# EAGLE design board (EAGLE 9.5.2)
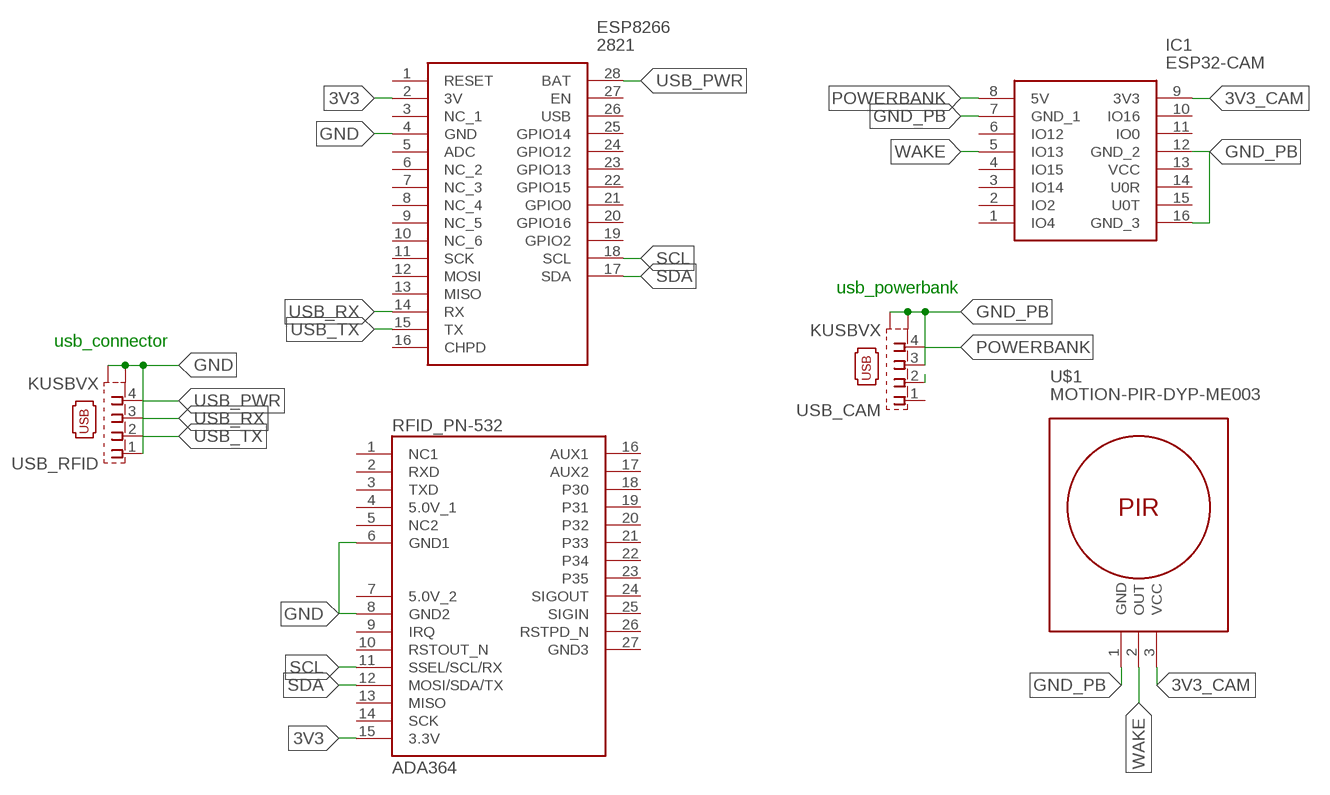
[diagram p0: schematic, sheet 1]

## Parts
ESP8266  2821  [2821]
IC1  ESP32-CAM  [ESP32CAM]
RFID_PN-532  ADA364  [ADAFRUIT_ADA364]
U$1  MOTION-PIR-DYP-ME003  [MOTION-PIR-DYP-ME003]
USB_CAM  KUSBVX  [KUSBVX]
USB_RFID  KUSBVX  [KUSBVX]

## Nets
3V3: ESP8266.2(3V) RFID_PN-532.15(3.3V)
3V3_CAM: IC1.9(3V3) U$1.3(VCC)
GND: ESP8266.4(GND) RFID_PN-532.6(GND1) RFID_PN-532.8(GND2) USB_RFID.1 USB_RFID.M1(S1) USB_RFID.M2(S2)
GND_PB: IC1.7(GND_1) IC1.12(GND_2) IC1.16(GND_3) U$1.1(GND) USB_CAM.3 USB_CAM.M1(S1) USB_CAM.M2(S2)
N$1: USB_CAM.1 USB_CAM.2
POWERBANK: IC1.8(5V) USB_CAM.4
SCL: ESP8266.18(SCL) RFID_PN-532.11(SSEL/SCL/RX)
SDA: ESP8266.17(SDA) RFID_PN-532.12(MOSI/SDA/TX)
USB_PWR: ESP8266.28(BAT) USB_RFID.4
USB_RX: ESP8266.14(RX) USB_RFID.3
USB_TX: ESP8266.15(TX) USB_RFID.2
WAKE: IC1.5(IO13) U$1.2(OUT)
Unconnected: ESP8266.1(RESET) ESP8266.3(NC_1) ESP8266.5(ADC) ESP8266.6(NC_2) ESP8266.7(NC_3) ESP8266.8(NC_4) ESP8266.9(NC_5) ESP8266.10(NC_6) ESP8266.11(SCK) ESP8266.12(MOSI) ESP8266.13(MISO) ESP8266.16(CHPD) ESP8266.19(GPIO2) ESP8266.20(GPIO16) ESP8266.21(GPIO0) ESP8266.22(GPIO15) ESP8266.23(GPIO13) ESP8266.24(GPIO12) ESP8266.25(GPIO14) ESP8266.26(USB) ESP8266.27(EN) IC1.1(IO4) IC1.2(IO2) IC1.3(IO14) IC1.4(IO15) IC1.6(IO12) IC1.10(IO16) IC1.11(IO0) IC1.13(VCC) IC1.14(U0R) IC1.15(U0T) RFID_PN-532.1(NC1) RFID_PN-532.2(RXD) RFID_PN-532.3(TXD) RFID_PN-532.4(5.0V_1) RFID_PN-532.5(NC2) RFID_PN-532.7(5.0V_2) RFID_PN-532.9(IRQ) RFID_PN-532.10(RSTOUT_N) RFID_PN-532.13(MISO) RFID_PN-532.14(SCK) RFID_PN-532.16(AUX1) RFID_PN-532.17(AUX2) RFID_PN-532.18(P30) RFID_PN-532.19(P31) RFID_PN-532.20(P32) RFID_PN-532.21(P33) RFID_PN-532.22(P34) RFID_PN-532.23(P35) RFID_PN-532.24(SIGOUT) RFID_PN-532.25(SIGIN) RFID_PN-532.26(RSTPD_N) RFID_PN-532.27(GND3)

## Notes on the sheet
- usb_powerbank
- usb_connector

## Library data of the parts
ESP8266 = 2821:2821: ADAFRUIT - 2821 - Adafruit Feather HUZZAH ESP8266 Source: Datasheet <https://cdn-learn.adafruit.com/downloads/pdf/adafruit-feather-huzzah-esp8266.pdf>; ALLIED_NUMBER: 70929322; ALLIED_PRICE-STOCK: https://www.alliedelec.com/adafruit-industries-2821/70929322/; DESCRIPTION: ADAFRUIT - 2821 - Adafruit Feather HUZZAH ESP8266; HEIGHT: 4mm; MANUFACTURER_NAME: Adafruit; MANUFACTURER_PART_NUMBER: 2821; MOUSER_PART_NUMBER: 485-2821; MOUSER_PRICE-STOCK: https://www.mouser.com/Search/Refine.aspx?Keyword=485-2821; RS_PART_NUMBER: 1245505; RS_PRICE-STOCK: http://uk.rs-online.com/web/p/products/1245505
IC1 = ESP32-CAM:ESP32-CAM: Modules PCBA Module RoHS Source: Datasheet <https://datasheet.lcsc.com/szlcsc/Ai-Thinker-ESP32-CAM_C277946.pdf>; DESCRIPTION: Modules PCBA Module RoHS; HEIGHT: 5mm; MANUFACTURER_NAME: Ai-Thinker; MANUFACTURER_PART_NUMBER: ESP32-CAM
RFID_PN-532 = ADA364:ADA364: PN532 NFC/RFID controller breakout board; AVAILABILITY: Unavailable; DESCRIPTION: PN532 NFC/RFID controller breakout board; MF: Adafruit Industries; MP: ADA364; PACKAGE: None; PRICE: None
U$1 = diy-modules:MOTION-PIR-DYP-ME003: PIR Motion Sensor Module DYP-ME003 based on BISS0001 pyroelectic detector Click here to find device on ebay.com <http://www.ebay.com/sch/dyp+me003>
USB_CAM USB_RFID = con-kycon:KUSBVX: Vertical,Top Entry Universal Serial Bus Connector KUSBVX Series Source: KYCON Sibalco USB vertical socket KUSBV.pdf

## Board
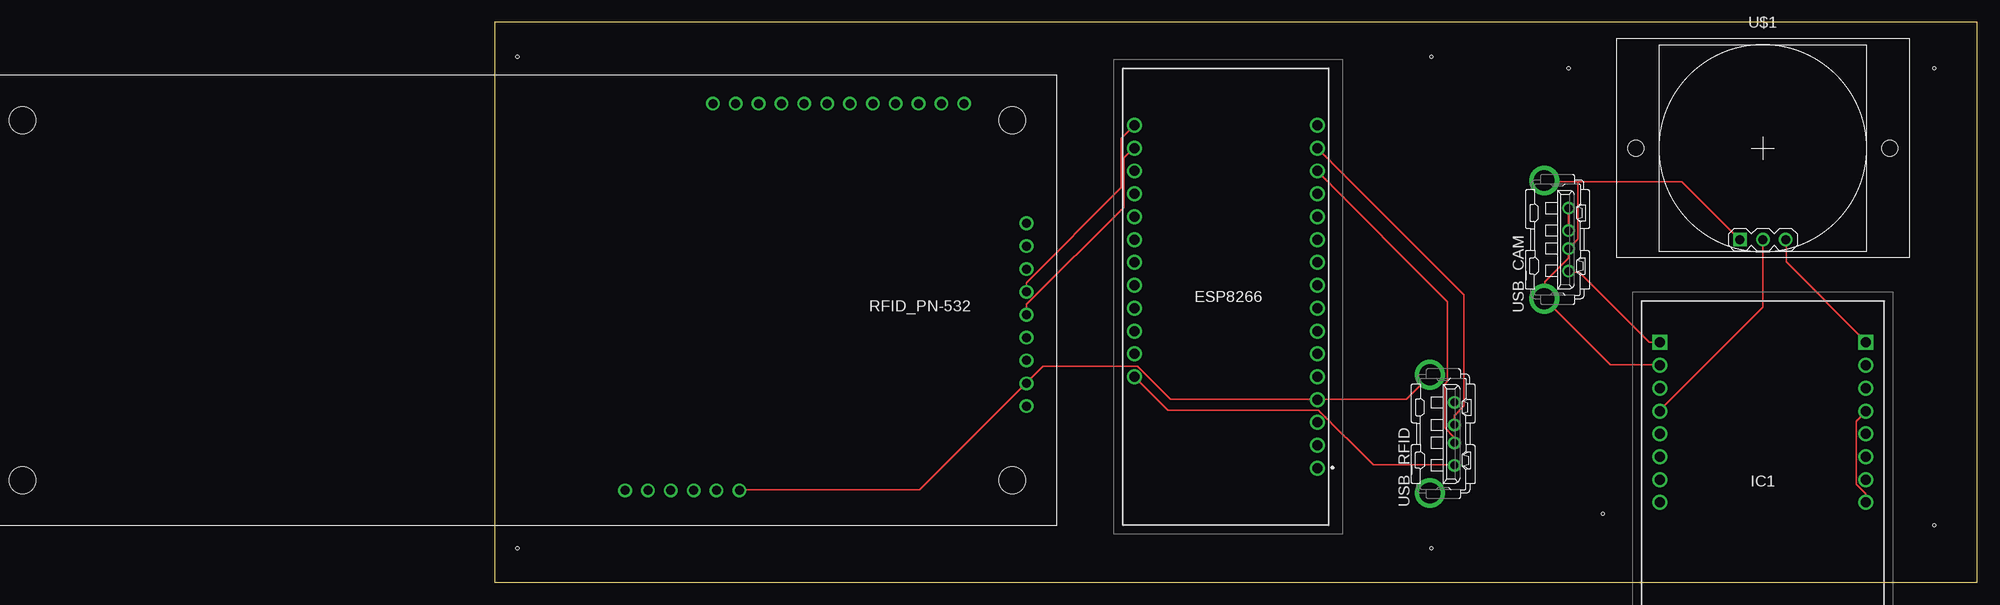
[diagram p1: board, top side]
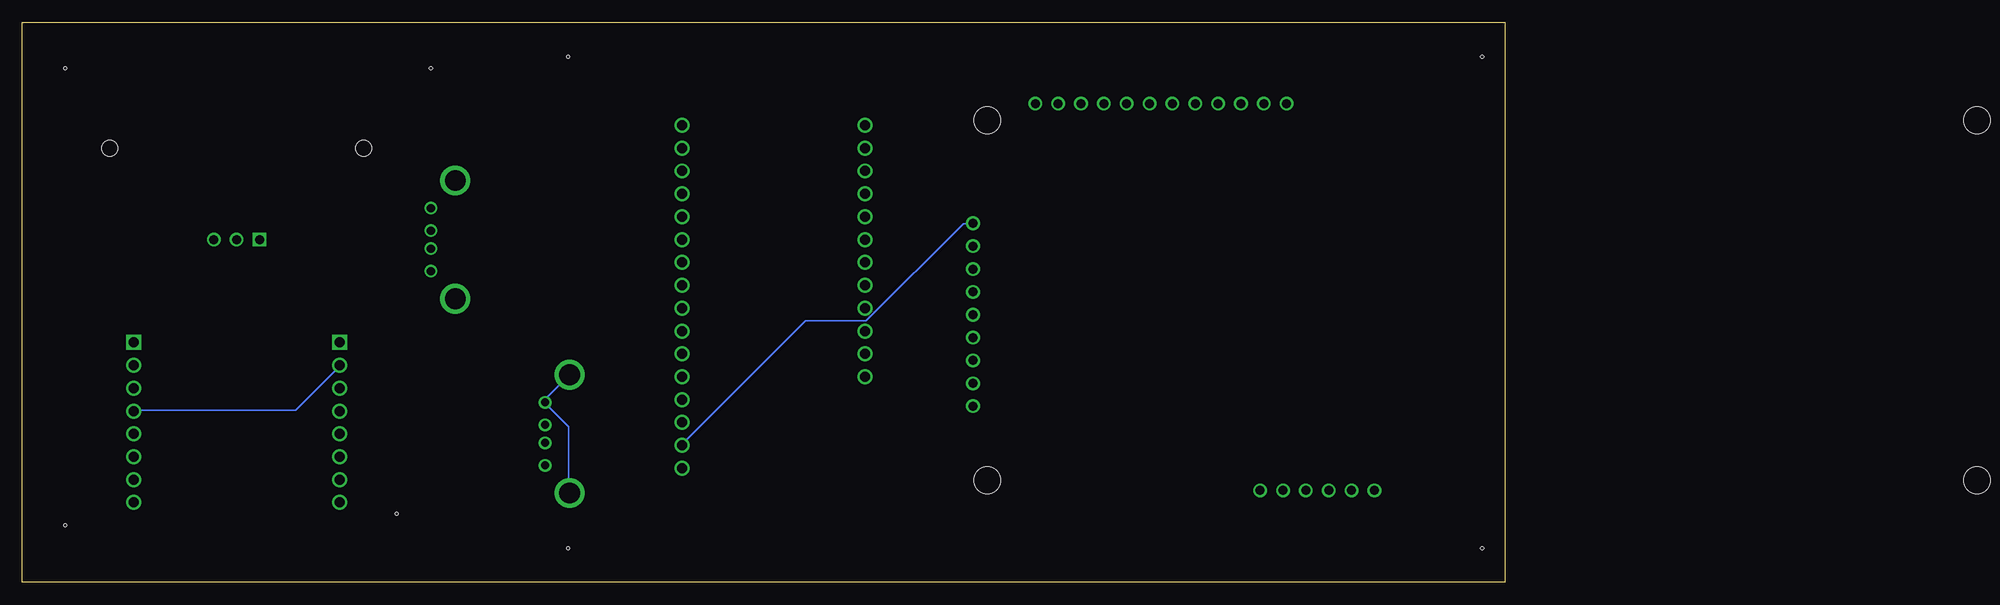
[diagram p2: board, bottom side, seen from below]

Size 164.77 x 62.22 mm. Coordinates in mm from the lower left corner, seen from the top.
Outline: 0,0 164.77,0 164.77,62.22 0,62.22 0,0
Copper layers (1*16): Top 0.035mm / dielectric 1.5mm / Bottom 0.035mm
Design rules "default": minimum track width 6mil, minimum drill 0.35mm, track to track 6mil, track to pad 6mil, pad to pad 6mil, via to via 6mil, smd to smd 6mil, copper to edge 40mil, drill to drill 6mil, minimum pad ring 10mil, minimum via ring 8mil, stop-mask expansion 4mil, vias tented up to drill 0mil, thermal gap 10mil
Holes 0.35 mm at 2.54,58.42 2.54,3.81 104.14,3.81 104.14,58.42 119.38,57.15 123.19,7.62 160.02,57.15 160.02,6.35

### Footprints (pad centres in the part's own frame; a part is rotated, then mirrored left to right if it is on the bottom)
2821 = drill 1.11 pad 1.665: 1 -35.56,0; 2 -33.02,0; 3 -30.48,0; 4 -27.94,0; 5 -25.4,0; 6 -22.86,0; 7 -20.32,0; 8 -17.78,0; 9 -15.24,0; 10 -12.7,0; 11 -10.16,0; 12 -7.62,0; 13 -5.08,0; 14 -2.54,0; 15 0,0; 16 2.54,0; 17 2.54,20.32; 18 0,20.32; 19 -2.54,20.32; 20 -5.08,20.32; 21 -7.62,20.32; 22 -10.16,20.32; 23 -12.7,20.32; 24 -15.24,20.32; 25 -17.78,20.32; 26 -20.32,20.32; 27 -22.86,20.32; 28 -25.4,20.32
ESP32CAM = drill 1.11 pad 1.665: 1 0,0; 2 0,2.54; 3 0,5.08; 4 0,7.62; 5 0,10.16; 6 0,12.7; 7 0,15.24; 10 22.86,15.24; 11 22.86,12.7; 12 22.86,10.16; 13 22.86,7.62; 14 22.86,5.08; 15 22.86,2.54; 16 22.86,0 | drill 1.11 pad 1.665 square: 8 0,17.78; 9 22.86,17.78
ADAFRUIT_ADA364 = drill 1: 1 11.976,3.874; 2 14.516,3.874; 3 17.056,3.874; 4 19.596,3.874; 5 22.136,3.874; 6 24.676,3.874; 7 56.59,13.24; 8 56.59,15.78; 9 56.59,18.32; 10 56.59,20.86; 11 56.59,23.4; 12 56.59,25.94; 13 56.59,28.48; 14 56.59,31.02; 15 56.59,33.56; 16 49.67,46.866; 17 47.13,46.866; 18 44.59,46.866; 19 42.05,46.866; 20 39.51,46.866; 21 36.97,46.866; 22 34.43,46.866; 23 31.89,46.866; 24 29.35,46.866; 25 26.81,46.866; 26 24.27,46.866; 27 21.73,46.866 | hole 3: -55,45; -55,5; 55,5; 55,45
MOTION-PIR-DYP-ME003 = drill 1 square: 1 -2.54,-10.16 | drill 1: 2 0,-10.16; 3 2.54,-10.16 | hole 1.8: -14.1,0; 14.1,0
KUSBVX = drill 0.9 pad 1.3: 1 3.5,0; 2 1,0; 3 -1,0; 4 -3.5,0 | drill 2.3 pad 2.8: M1 -6.57,2.71; M2 6.57,2.71

### Placement (x,y rotation side)
ESP8266  91.44,48.26 90 top
IC1  129.54,8.89 0 top
RFID_PN-532  2.54,6.35 0 top
U$1  140.97,48.26 0 top
USB_CAM  119.38,38.1 90 top
USB_RFID  106.68,16.51 90 top

### Tracks (layer width: path | path; a pad name or v marks a point on that pad's centre or on a via)
3V3
  Bottom 0.152: RFID_PN-532.15 59.13,39.88 60.2,39.88 71.02,29.06 77.72,29.06 91.44,15.34 ESP8266.2
3V3_CAM
  Top 0.152: U$1.3 143.56,38.05 143.56,35.61 152.4,26.77 IC1.9
GND
  Top 0.152: 91.44,20.37 101.35,20.37 103.94,22.96 USB_RFID.M2 | RFID_PN-532.6 27.28,10.31 47.24,10.31 58.98,22.05 RFID_PN-532.8 59.13,22.2 60.96,24.03 71.48,24.03 75.13,20.37 91.44,20.37 | 91.44,20.37 ESP8266.4
  Bottom 0.152: USB_RFID.M2 104.09,22.96 106.68,20.37 USB_RFID.1 106.68,19.91 104.09,17.32 104.09,10.01 USB_RFID.M1
GND_PB
  Top 0.152: 120.4,44.55 116.74,44.55 USB_CAM.M2 | U$1.1 131.98,44.55 120.4,44.55 | IC1.16 152.4,9.86 151.33,10.92 151.33,17.93 152.4,19 IC1.12 | IC1.7 129.54,24.18 124,24.18 116.74,31.45 USB_CAM.M1 116.74,31.6 116.74,33.43 119.33,36.02 119.33,37.08 USB_CAM.3 119.48,37.24 120.4,38.15 120.4,44.55
  Bottom 0.152: IC1.12 152.4,19.15 134.42,19.15 129.54,24.03 IC1.7
N$1
  Top 0.152: USB_CAM.2 119.33,39.22 119.33,41.5 USB_CAM.1
POWERBANK
  Top 0.152: IC1.8 128.37,26.67 120.55,34.49 119.48,34.49 USB_CAM.4
SCL
  Top 0.152: RFID_PN-532.11 59.13,29.82 59.13,30.89 69.95,41.71 69.95,47.19 71.02,48.26 ESP8266.18
SDA
  Top 0.152: ESP8266.17 69.65,49.33 69.65,43.84 59.13,33.33 59.13,32.41 RFID_PN-532.12
USB_PWR
  Top 0.152: ESP8266.28 74.83,19.15 91.59,19.15 97.69,13.06 106.68,13.06 USB_RFID.4
USB_RX
  Top 0.152: USB_RFID.3 106.68,16.1 105.61,17.17 105.61,22.05 105.92,22.35 105.92,31.19 91.44,45.67 ESP8266.14
USB_TX
  Top 0.152: USB_RFID.2 106.68,18.54 107.75,19.61 107.75,31.95 ESP8266.15
WAKE
  Top 0.152: U$1.2 140.97,30.58 129.54,19.15 IC1.5